# EasyEDA Pro project chunithm.epro, schematic Schematic1
Create Date: 2023-06-18; Page Name: P1; Project Name: chunithm_psoc; Schematic Name: Schematic1; Update Date: 2023-06-19; Company: 嘉立创EDA; Page Size: A3; Version: V1.0
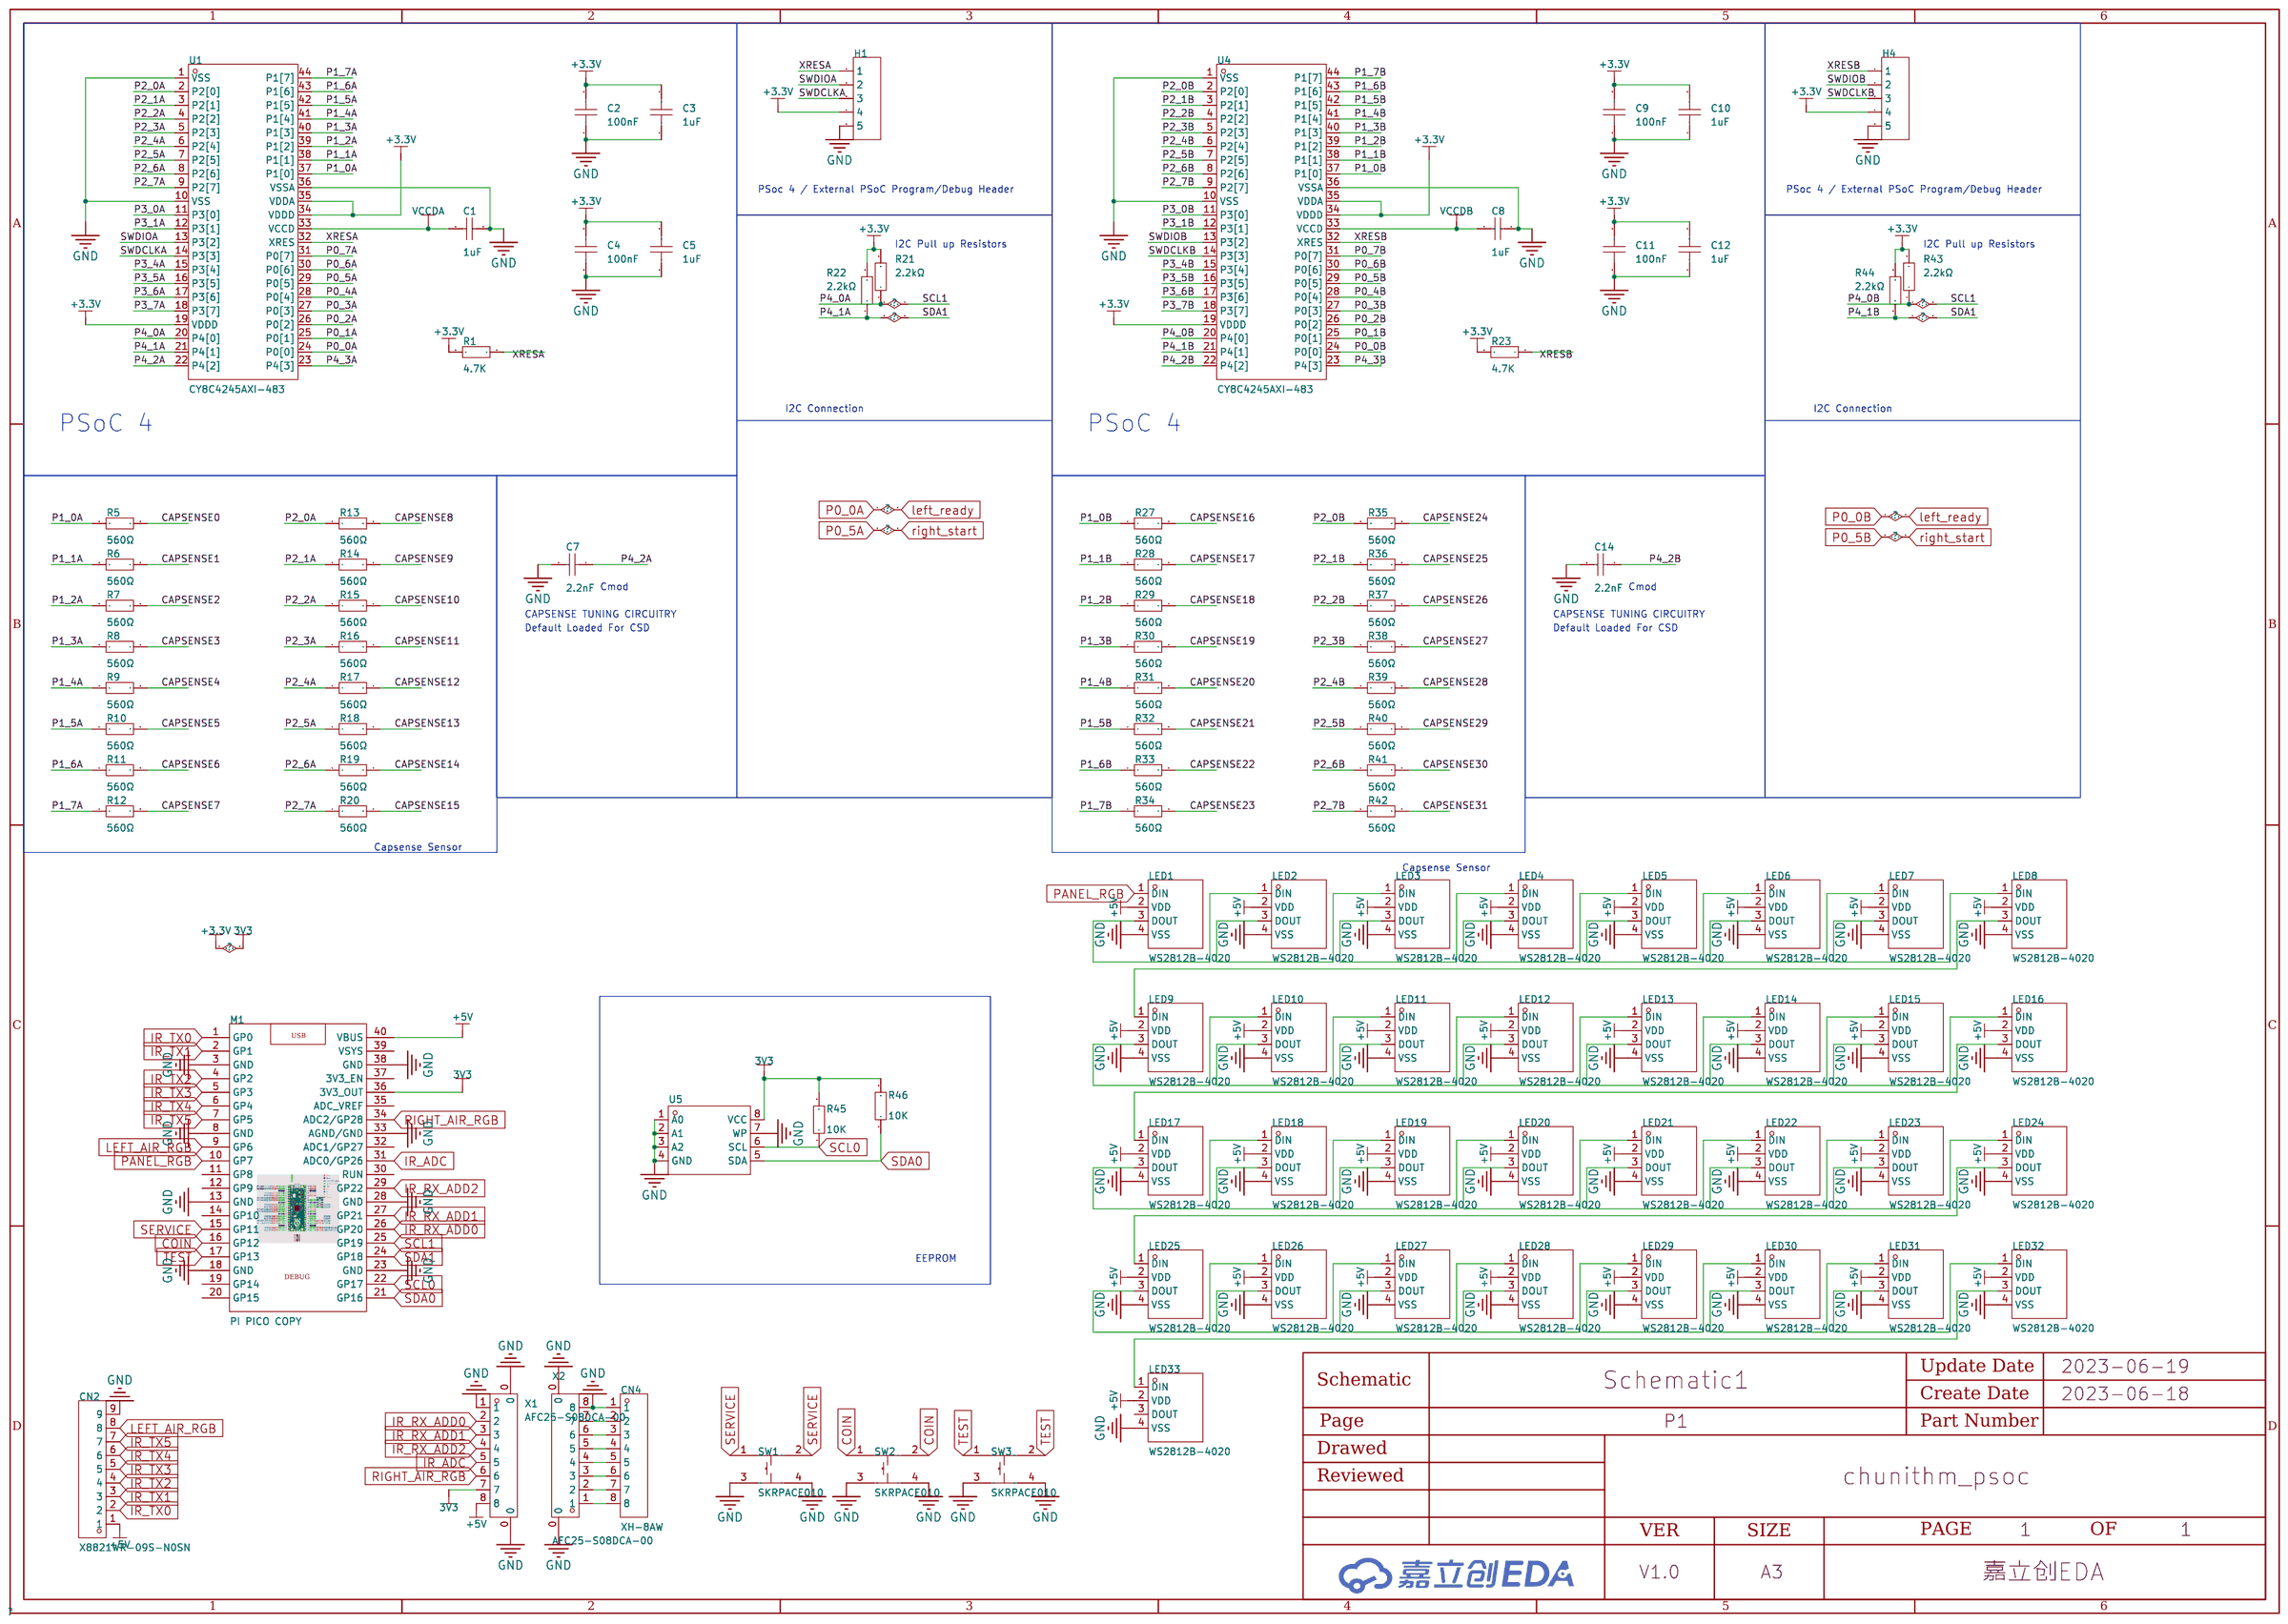
[diagram p0: schematic sheet]

## Parts
C1  1uF  [C0603]
C2  100nF  [C0603]
C3  1uF  [C0603]
C4  100nF  [C0603]
C5  1uF  [C0603]
C7  2.2nF  [C0603]
C8  1uF  [C0603]
C9  100nF  [C0603]
C10  1uF  [C0603]
C11  100nF  [C0603]
C12  1uF  [C0603]
C14  2.2nF  [C0603]
CN2  X8821WR-09S-N0SN  [CONN-TH_9P-P2.50_X8821WR-09S-N2SN]
CN4  XH-8AW  [CONN-TH_8P-P2.54_HCTL_XH-8AW_C2908617]
H1  -  [HDR-TH_5P-P2.54-V-F]
H4  -  [HDR-TH_5P-P2.54-V-F]
LED1  WS2812B-4020  [LED-SMD_WS2812B-4020]
LED2  WS2812B-4020  [LED-SMD_WS2812B-4020]
LED3  WS2812B-4020  [LED-SMD_WS2812B-4020]
LED4  WS2812B-4020  [LED-SMD_WS2812B-4020]
LED5  WS2812B-4020  [LED-SMD_WS2812B-4020]
LED6  WS2812B-4020  [LED-SMD_WS2812B-4020]
LED7  WS2812B-4020  [LED-SMD_WS2812B-4020]
LED8  WS2812B-4020  [LED-SMD_WS2812B-4020]
LED9  WS2812B-4020  [LED-SMD_WS2812B-4020]
LED10  WS2812B-4020  [LED-SMD_WS2812B-4020]
LED11  WS2812B-4020  [LED-SMD_WS2812B-4020]
LED12  WS2812B-4020  [LED-SMD_WS2812B-4020]
LED13  WS2812B-4020  [LED-SMD_WS2812B-4020]
LED14  WS2812B-4020  [LED-SMD_WS2812B-4020]
LED15  WS2812B-4020  [LED-SMD_WS2812B-4020]
LED16  WS2812B-4020  [LED-SMD_WS2812B-4020]
LED17  WS2812B-4020  [LED-SMD_WS2812B-4020]
LED18  WS2812B-4020  [LED-SMD_WS2812B-4020]
LED19  WS2812B-4020  [LED-SMD_WS2812B-4020]
LED20  WS2812B-4020  [LED-SMD_WS2812B-4020]
LED21  WS2812B-4020  [LED-SMD_WS2812B-4020]
LED22  WS2812B-4020  [LED-SMD_WS2812B-4020]
LED23  WS2812B-4020  [LED-SMD_WS2812B-4020]
LED24  WS2812B-4020  [LED-SMD_WS2812B-4020]
LED25  WS2812B-4020  [LED-SMD_WS2812B-4020]
LED26  WS2812B-4020  [LED-SMD_WS2812B-4020]
LED27  WS2812B-4020  [LED-SMD_WS2812B-4020]
LED28  WS2812B-4020  [LED-SMD_WS2812B-4020]
LED29  WS2812B-4020  [LED-SMD_WS2812B-4020]
LED30  WS2812B-4020  [LED-SMD_WS2812B-4020]
LED31  WS2812B-4020  [LED-SMD_WS2812B-4020]
LED32  WS2812B-4020  [LED-SMD_WS2812B-4020]
LED33  WS2812B-4020  [LED-SMD_WS2812B-4020]
M1  PI PICO COPY  [pipico]
R1  4.7K  [R0603]
R5  560Ω  [R0603]
R6  560Ω  [R0603]
R7  560Ω  [R0603]
R8  560Ω  [R0603]
R9  560Ω  [R0603]
R10  560Ω  [R0603]
R11  560Ω  [R0603]
R12  560Ω  [R0603]
R13  560Ω  [R0603]
R14  560Ω  [R0603]
R15  560Ω  [R0603]
R16  560Ω  [R0603]
R17  560Ω  [R0603]
R18  560Ω  [R0603]
R19  560Ω  [R0603]
R20  560Ω  [R0603]
R21  2.2kΩ  [R0603]
R22  2.2kΩ  [R0603]
R23  4.7K  [R0603]
R27  560Ω  [R0603]
R28  560Ω  [R0603]
R29  560Ω  [R0603]
R30  560Ω  [R0603]
R31  560Ω  [R0603]
R32  560Ω  [R0603]
R33  560Ω  [R0603]
R34  560Ω  [R0603]
R35  560Ω  [R0603]
R36  560Ω  [R0603]
R37  560Ω  [R0603]
R38  560Ω  [R0603]
R39  560Ω  [R0603]
R40  560Ω  [R0603]
R41  560Ω  [R0603]
R42  560Ω  [R0603]
R43  2.2kΩ  [R0603]
R44  2.2kΩ  [R0603]
R45  10K  [R0402]
R46  10K  [R0402]
SW1  SKRPACE010  [KEY-SMD_4P-L4.2-W3.2-P2.20-LS4.6]
SW2  SKRPACE010  [KEY-SMD_4P-L4.2-W3.2-P2.20-LS4.6]
SW3  SKRPACE010  [KEY-SMD_4P-L4.2-W3.2-P2.20-LS4.6]
U1  CY8C4245AXI-483  [TQFP-44_L10.0-W10.0-P0.80-BL]
U4  CY8C4245AXI-483  [TQFP-44_L10.0-W10.0-P0.80-BL]
U5  -  [TSSOP-8_L4.4-W3.0-P0.65-LS6.4-BL]
X1  AFC25-S08DCA-00  [CONN-SMD_8P-P2.50-L10.5-W25.0]
X2  AFC25-S08DCA-00  [CONN-SMD_8P-P2.50-L10.5-W25.0]

## Library data of the parts
C1 C8 = CL10A105KB8NNNC: 容值:1uF;精度:±10%;额定电压:50V;材质(温度系数):X5R;; LCSC Part Name: 1uF ±10% 50V; Supplier Part: C15849; Manufacturer: SAMSUNG(三星); Supplier Footprint: 0603; JLCPCB Part Class: Basic Part; Datasheet: https://atta.szlcsc.com/upload/public/pdf/source/20160103/1457707679084.pdf; Supplier: LCSC; Tolerance: ±10%; Voltage Rated: 50V; Temperature Coefficient: X5R
C2 C4 C9 C11 = CL10B104KB8NNNC: 容值:100nF;精度:±10%;额定电压:50V;材质(温度系数):X7R;; LCSC Part Name: 100nF ±10% 50V; Supplier Part: C1591; Manufacturer: SAMSUNG(三星); Supplier Footprint: 0603; JLCPCB Part Class: Extended Part; Datasheet: https://atta.szlcsc.com/upload/public/pdf/source/20160103/1457707680512.pdf; Supplier: LCSC; Tolerance: ±10%; Voltage Rated: 50V; Temperature Coefficient: X7R
C3 C5 C10 C12 = CC0603KRX7R9BB105: 容值:1uF;精度:±10%;额定电压:50V;材质(温度系数):X7R;; LCSC Part Name: 1uF ±10% 50V; Supplier Part: C559769; Manufacturer: YAGEO(国巨); Supplier Footprint: 0603; JLCPCB Part Class: Extended Part; Datasheet: https://atta.szlcsc.com/upload/public/pdf/source/20181031/C325451_C7CF01155AE3010E0D610C52F5FE7D31.pdf; Supplier: LCSC; Tolerance: ±10%; Voltage Rated: 50V; Temperature Coefficient: X7R
C7 C14 = CC0603KRX7R9BB222: 容值:2.2nF;精度:±10%;额定电压:50V;材质(温度系数):X7R;; LCSC Part Name: 2.2nF ±10% 50V; Supplier Part: C107082; Manufacturer: YAGEO(国巨); Supplier Footprint: 0603; JLCPCB Part Class: Extended Part; Datasheet: https://atta.szlcsc.com/upload/public/pdf/source/20170420/1492670716015.pdf; Supplier: LCSC; Tolerance: ±10%; Voltage Rated: 50V; Temperature Coefficient: X7R
CN2 = X8821WR-09S-N0SN: 参考系列:XH;间距:2.5mm;插针结构:1x9P;排数:1;每排PIN数:9;行距:-;公母:母型插口;安装方式:弯插;额定电流:3A;触头材质:黄铜;触头镀层:锡;工作温度范围:-25℃~+85℃;焊接温度(最大值):260℃;; LCSC Part Name: XH 2.5mm 1x9P 弯插 XH; Supplier Part: C388746; Manufacturer: XKB Connectivity(中国星坤); Supplier Footprint: 弯插,P=2.54mm; JLCPCB Part Class: Extended Part; Datasheet: https://atta.szlcsc.com/upload/public/pdf/source/20211009/984C14C41D2B1156BCF8EEF5D296E395.pdf; Supplier: LCSC; Reference Series: XH; Pitch: 2.5mm; Pins Structure: 1x9P; Number of Rows: 1; Number of PINs Per Row: 9; Gender: 母型插口; Mounting Style: 弯插; Current Rating (Max): 3A; Contact Material: 黄铜; Contact Plating: 锡; Operating Temperature Range: -25℃~+85℃; Welding Temperature (Max): 260℃
CN4 = XH-8AW: 参考系列:XH;间距:2.54mm;插针结构:1x8P;排数:1;每排PIN数:8;行距:-;公母:公型插针;安装方式:弯插;额定电流:3A;工作温度范围:-25℃~+85℃;; LCSC Part Name: XH 2.54mm 1x8P 弯插; Supplier Part: C2908617; Manufacturer: HCTL(华灿天禄); Supplier Footprint: 弯插,P=2.54mm; JLCPCB Part Class: Extended Part; Datasheet: https://atta.szlcsc.com/upload/public/pdf/source/20211021/ACA2D54D99493880102FCACAC8DAABA8.pdf; Supplier: LCSC; Reference Series: XH; Pitch: 2.54mm; Pins Structure: 1x8P; Number of Rows: 1; Number of PINs Per Row: 8; Gender: 公型插针; Mounting Style: 弯插; Current Rating (Max): 3A; Operating Temperature Range: -25℃~+85℃
H1 H4 = HDR-F_2.54_1x5P: Supplier Part: C50950; Supplier Footprint: 插件; Check: false
LED1-LED33 = WS2812B-4020: 发光颜色:RGB三色;二极管配置:-;主波长:465nm~475nm；620nm~625nm；515nm~525nm;色温:-;功率:-;安装方式:-;; LCSC Part Name: RGB三色 （注意防潮，请查阅规格书中对应具体内容）; Supplier Part: C965557; Manufacturer: worldsemi; Supplier Footprint: SMD,2x4mm; JLCPCB Part Class: Extended Part; Datasheet: https://atta.szlcsc.com/upload/public/pdf/source/20201203/C965557_D4D919E14814D6BA44043987D39B5520.pdf; Supplier: LCSC; Emitted Color: RGB三色; Dominant Wavelength: 465nm~475nm；620nm~625nm；515nm~525nm; Forward Current: 12mA
M1 = PI PICO COPY: link: https://datasheets.raspberrypi.org/pico/pico-product-brief.pdf
R1 R23 = Res_0603: Supplier Footprint: 0603
R5-R20 R27-R42 = 0603WAF5600T5E: 电阻类型:厚膜电阻;阻值:560Ω;精度:±1%;功率:100mW;; LCSC Part Name: 560Ω ±1% 100mW; Supplier Part: C23204; Manufacturer: UNI-ROYAL(厚声); Supplier Footprint: 0603; JLCPCB Part Class: Basic Part; Datasheet: https://atta.szlcsc.com/upload/public/pdf/source/20200306/C422600_1E6D84923E4A46A82E41ADD87F860B5C.pdf; Supplier: LCSC; Type: 厚膜电阻; Tolerance: ±1%; Power(Watts): 100mW; Temperature Coefficient: ±100ppm/℃; Overload Voltage (Max): 75V; Operating Temperature Range: -55℃~+155℃
R21 R22 R43 R44 = 0603WAF2201T5E: 电阻类型:厚膜电阻;阻值:2.2kΩ;精度:±1%;功率:100mW;; LCSC Part Name: 2.2kΩ ±1% 100mW; Supplier Part: C4190; Manufacturer: UNI-ROYAL(厚声); Supplier Footprint: 0603; JLCPCB Part Class: Basic Part; Datasheet: https://atta.szlcsc.com/upload/public/pdf/source/20200306/C422600_1E6D84923E4A46A82E41ADD87F860B5C.pdf; Supplier: LCSC; Type: 厚膜电阻; Tolerance: ±1%; Power(Watts): 100mW; Temperature Coefficient: ±100ppm/℃; Overload Voltage (Max): 75V; Operating Temperature Range: -55℃~+155℃
R45 R46 = Res_0402: Supplier Footprint: 0402
SW1-SW3 = SKRPACE010: 触点电流:50mA;额定电压(DC):16V;电路结构:单刀单掷;安装方式:立贴;带灯:-;机械寿命:-;; LCSC Part Name: 4.2*3.2*2.5mm 立贴 轻触开关; Supplier Part: C139797; Manufacturer: ALPSALPINE(阿尔卑斯阿尔派); Supplier Footprint: SMD; JLCPCB Part Class: Extended Part; Datasheet: https://atta.szlcsc.com/upload/public/pdf/source/20171113/C139797_15105612676371115729.pdf; Supplier: LCSC; Contact Current: 50mA; Voltage Rating (DC): 16V; Circuit: 单刀单掷; Mounting Style: 立贴; Actuator Style: 椭圆形按钮; Switch Length: 4.2mm; Switch Width: 3.2mm; Switch Height: 2.5mm
U1 U4 = CY8C4245AXI-483: CPU最大主频:48MHz;程序存储容量:32KB;GPIO端口数量:36;; LCSC Part Name: 48MHz; Supplier Part: C462527; Manufacturer: CYPRESS(赛普拉斯); Supplier Footprint: TQFP-44(10x10); JLCPCB Part Class: Extended Part; Datasheet: https://atta.szlcsc.com/upload/public/pdf/source/20200102/C475891_D692656D7ACA53C6511AD0E00550D7D7.pdf; Supplier: LCSC; CPU Maximum Speed: 48MHz; Operating Voltage Range: 1.71V~5.5V; Program Storage Size: 32KB; GPIO Ports Number: 36; ADC (Bit): 12bit; Watchdog: 有; Infrared Data Association: 有; Low-Voltage Detect: 有; LCD Module: 有; Internal Oscillator: 有; Operating Temperature Range: 40℃~+85℃
U5 = BL24C512A-SFRC: 存储器容量:512Kb (64K x 8);存储器接口类型:I2C;工作电压:1.7V ~ 5.5V;; Supplier Part: C169114; Manufacturer: BL(上海贝岭); Supplier Footprint: TSSOP-8_3x4.4x065P; JLCPCB Part Class: Extended Part; Datasheet: https://atta.szlcsc.com/upload/public/pdf/source/20180126/C169114_15169517524601308555.pdf; Supplier: LCSC; Memory Format: EEPROM; Memory Size: 512Kb (64K x 8); Memory Interface: I2C; Voltage - Supply: 1.7V ~ 5.5V
X1 X2 = AFC25-S08DCA-00: 参考系列:XH;间距:2.5mm;插针结构:1x8P;排数:1;每排PIN数:8;行距:-;公母:公型插针;安装方式:卧贴;额定电流:3A;工作温度范围:-20℃~+85℃;; LCSC Part Name: XH 2.5mm 卧式贴片 8P; Supplier Part: C2764247; Manufacturer: JS(钜硕电子); Supplier Footprint: SMD,P=2.5mm; JLCPCB Part Class: Extended Part; Datasheet: https://atta.szlcsc.com/upload/public/pdf/source/20210330/C2764241_412E231661FA78F85357ABAC285E64EE.pdf; Supplier: LCSC; Reference Series: XH; Pitch: 2.5mm; Pins Structure: 1x8P; Number of Rows: 1; Number of PINs Per Row: 8; Gender: 公型插针; Mounting Style: 卧贴; Current Rating (Max): 3A; Operating Temperature Range: -20℃~+85℃

## Nets
+3.3V: C2.2 C3.2 C4.2 C5.2 C9.2 C10.2 C11.2 C12.2 H1.4 H4.4 M1.36(3V3_OUT) R1.2 R21.2 R22.2 R23.2 R43.2 R44.2 R45.2 R46.2 U1.19(VDDD) U1.34(VDDD) U1.35(VDDA) U4.19(VDDD) U4.34(VDDD) U4.35(VDDA) U5.8(VCC) X1.7
+5V: CN2.1 LED1.2(VDD) LED2.2(VDD) LED3.2(VDD) LED4.2(VDD) LED5.2(VDD) LED6.2(VDD) LED7.2(VDD) LED8.2(VDD) LED9.2(VDD) LED10.2(VDD) LED11.2(VDD) LED12.2(VDD) LED13.2(VDD) LED14.2(VDD) LED15.2(VDD) LED16.2(VDD) LED17.2(VDD) LED18.2(VDD) LED19.2(VDD) LED20.2(VDD) LED21.2(VDD) LED22.2(VDD) LED23.2(VDD) LED24.2(VDD) LED25.2(VDD) LED26.2(VDD) LED27.2(VDD) LED28.2(VDD) LED29.2(VDD) LED30.2(VDD) LED31.2(VDD) LED32.2(VDD) LED33.2(VDD) M1.40(VBUS) X1.8
GND: C1.2 C2.1 C3.1 C4.1 C5.1 C7.2 C8.2 C9.1 C10.1 C11.1 C12.1 C14.2 CN2.9 CN4.1 H1.5 H4.5 LED1.4(VSS) LED2.4(VSS) LED3.4(VSS) LED4.4(VSS) LED5.4(VSS) LED6.4(VSS) LED7.4(VSS) LED8.4(VSS) LED9.4(VSS) LED10.4(VSS) LED11.4(VSS) LED12.4(VSS) LED13.4(VSS) LED14.4(VSS) LED15.4(VSS) LED16.4(VSS) LED17.4(VSS) LED18.4(VSS) LED19.4(VSS) LED20.4(VSS) LED21.4(VSS) LED22.4(VSS) LED23.4(VSS) LED24.4(VSS) LED25.4(VSS) LED26.4(VSS) LED27.4(VSS) LED28.4(VSS) LED29.4(VSS) LED30.4(VSS) LED31.4(VSS) LED32.4(VSS) LED33.4(VSS) M1.3(GND) M1.8(GND) M1.13(GND) M1.18(GND) M1.23(GND) M1.28(GND) M1.33(AGND/GND) M1.38(GND) SW1.3 SW1.4 SW2.3 SW2.4 SW3.3 SW3.4 U1.1(VSS) U1.10(VSS) U1.36(VSSA) U4.1(VSS) U4.10(VSS) U4.36(VSSA) U5.1(A0) U5.2(A1) U5.3(A2) U5.4(GND) U5.7(WP) X1.0 X1.1 X2.0 X2.8
VCCDA: C1.1 U1.33(VCCD)
VCCDB: C8.1 U4.33(VCCD)
CAPSENSE0: R5.2
CAPSENSE1: R6.2
CAPSENSE2: R7.2
CAPSENSE3: R8.2
CAPSENSE4: R9.2
CAPSENSE5: R10.2
CAPSENSE6: R11.2
CAPSENSE7: R12.2
CAPSENSE8: R13.2
CAPSENSE9: R14.2
CAPSENSE10: R15.2
CAPSENSE11: R16.2
CAPSENSE12: R17.2
CAPSENSE13: R18.2
CAPSENSE14: R19.2
CAPSENSE15: R20.2
CAPSENSE16: R27.2
CAPSENSE17: R28.2
CAPSENSE18: R29.2
CAPSENSE19: R30.2
CAPSENSE20: R31.2
CAPSENSE21: R32.2
CAPSENSE22: R33.2
CAPSENSE23: R34.2
CAPSENSE24: R35.2
CAPSENSE25: R36.2
CAPSENSE26: R37.2
CAPSENSE27: R38.2
CAPSENSE28: R39.2
CAPSENSE29: R40.2
CAPSENSE30: R41.2
CAPSENSE31: R42.2
COIN: M1.16(GP12) SW2.1 SW2.2
IR_ADC: M1.31(ADC0/GP26) X1.5
IR_RX_ADD0: M1.26(GP20) X1.2
IR_RX_ADD1: M1.27(GP21) X1.3
IR_RX_ADD2: M1.29(GP22) X1.4
IR_TX0: CN2.2 M1.1(GP0)
IR_TX1: CN2.3 M1.2(GP1)
IR_TX2: CN2.4 M1.4(GP2)
IR_TX3: CN2.5 M1.5(GP3)
IR_TX4: CN2.6 M1.6(GP4)
IR_TX5: CN2.7 M1.7(GP5)
LEFT_AIR_RGB: CN2.8 M1.9(GP6)
P0_0A: U1.24(P0[0]) U4.24(P0[0])
P0_1A: U1.25(P0[1])
P0_1B: U4.25(P0[1])
P0_2A: U1.26(P0[2])
P0_2B: U4.26(P0[2])
P0_3A: U1.27(P0[3])
P0_3B: U4.27(P0[3])
P0_4A: U1.28(P0[4])
P0_4B: U4.28(P0[4])
P0_5A: U1.29(P0[5]) U4.29(P0[5])
P0_6A: U1.30(P0[6])
P0_6B: U4.30(P0[6])
P0_7A: U1.31(P0[7])
P0_7B: U4.31(P0[7])
P1_0A: R5.1 U1.37(P1[0])
P1_0B: R27.1 U4.37(P1[0])
P1_1A: R6.1 U1.38(P1[1])
P1_1B: R28.1 U4.38(P1[1])
P1_2A: R7.1 U1.39(P1[2])
P1_2B: R29.1 U4.39(P1[2])
P1_3A: R8.1 U1.40(P1[3])
P1_3B: R30.1 U4.40(P1[3])
P1_4A: R9.1 U1.41(P1[4])
P1_4B: R31.1 U4.41(P1[4])
P1_5A: R10.1 U1.42(P1[5])
P1_5B: R32.1 U4.42(P1[5])
P1_6A: R11.1 U1.43(P1[6])
P1_6B: R33.1 U4.43(P1[6])
P1_7A: R12.1 U1.44(P1[7])
P1_7B: R34.1 U4.44(P1[7])
P2_0A: R13.1 U1.2(P2[0])
P2_0B: R35.1 U4.2(P2[0])
P2_1A: R14.1 U1.3(P2[1])
P2_1B: R36.1 U4.3(P2[1])
P2_2A: R15.1 U1.4(P2[2])
P2_2B: R37.1 U4.4(P2[2])
P2_3A: R16.1 U1.5(P2[3])
P2_3B: R38.1 U4.5(P2[3])
P2_4A: R17.1 U1.6(P2[4])
P2_4B: R39.1 U4.6(P2[4])
P2_5A: R18.1 U1.7(P2[5])
P2_5B: R40.1 U4.7(P2[5])
P2_6A: R19.1 U1.8(P2[6])
P2_6B: R41.1 U4.8(P2[6])
P2_7A: R20.1 U1.9(P2[7])
P2_7B: R42.1 U4.9(P2[7])
P3_0A: U1.11(P3[0])
P3_0B: U4.11(P3[0])
P3_1A: U1.12(P3[1])
P3_1B: U4.12(P3[1])
P3_4A: U1.15(P3[4])
P3_4B: U4.15(P3[4])
P3_5A: U1.16(P3[5])
P3_5B: U4.16(P3[5])
P3_6A: U1.17(P3[6])
P3_6B: U4.17(P3[6])
P3_7A: U1.18(P3[7])
P3_7B: U4.18(P3[7])
P4_0A: M1.25(GP19) R21.1 R43.1 U1.20(P4[0]) U4.20(P4[0])
P4_1A: M1.24(GP18) R22.1 R44.1 U1.21(P4[1]) U4.21(P4[1])
P4_2A: C7.1 U1.22(P4[2])
P4_2B: C14.1 U4.22(P4[2])
P4_3A: U1.23(P4[3])
P4_3B: U4.23(P4[3])
PANEL_RGB: LED1.1(DIN) M1.10(GP7)
RIGHT_AIR_RGB: M1.34(ADC2/GP28) X1.6
SCL0: M1.22(GP17) R45.1 U5.6(SCL)
SDA0: M1.21(GP16) R46.1 U5.5(SDA)
SERVICE: M1.15(GP11) SW1.1 SW1.2
SWDCLKA: H1.3 U1.14(P3[3])
SWDCLKB: H4.3 U4.14(P3[3])
SWDIOA: H1.2 U1.13(P3[2])
SWDIOB: H4.2 U4.13(P3[2])
TEST: M1.17(GP13) SW3.1 SW3.2
XRESA: H1.1 R1.1 U1.32(XRES)
XRESB: H4.1 R23.1 U4.32(XRES)
$1N13625: LED1.3(DOUT) LED2.1(DIN)
$1N13632: LED2.3(DOUT) LED3.1(DIN)
$1N13639: LED3.3(DOUT) LED4.1(DIN)
$1N13646: LED4.3(DOUT) LED5.1(DIN)
$1N13653: LED5.3(DOUT) LED6.1(DIN)
$1N13660: LED6.3(DOUT) LED7.1(DIN)
$1N13667: LED7.3(DOUT) LED8.1(DIN)
$1N13674: LED8.3(DOUT) LED9.1(DIN)
$1N13680: LED9.3(DOUT) LED10.1(DIN)
$1N13687: LED10.3(DOUT) LED11.1(DIN)
$1N13694: LED11.3(DOUT) LED12.1(DIN)
$1N13701: LED12.3(DOUT) LED13.1(DIN)
$1N13708: LED13.3(DOUT) LED14.1(DIN)
$1N13715: LED14.3(DOUT) LED15.1(DIN)
$1N13722: LED15.3(DOUT) LED16.1(DIN)
$1N13729: LED16.3(DOUT) LED17.1(DIN)
$1N13735: LED17.3(DOUT) LED18.1(DIN)
$1N13742: LED18.3(DOUT) LED19.1(DIN)
$1N13749: LED19.3(DOUT) LED20.1(DIN)
$1N13756: LED20.3(DOUT) LED21.1(DIN)
$1N13763: LED21.3(DOUT) LED22.1(DIN)
$1N13770: LED22.3(DOUT) LED23.1(DIN)
$1N13777: LED23.3(DOUT) LED24.1(DIN)
$1N13784: LED24.3(DOUT) LED25.1(DIN)
$1N13790: LED25.3(DOUT) LED26.1(DIN)
$1N13797: LED26.3(DOUT) LED27.1(DIN)
$1N13804: LED27.3(DOUT) LED28.1(DIN)
$1N13811: LED28.3(DOUT) LED29.1(DIN)
$1N13818: LED29.3(DOUT) LED30.1(DIN)
$1N13825: LED30.3(DOUT) LED31.1(DIN)
$1N13832: LED31.3(DOUT) LED32.1(DIN)
$1N13839: LED32.3(DOUT) LED33.1(DIN)
$1N18505: CN4.2 X2.7
$1N18507: CN4.3 X2.6
$1N18509: CN4.4 X2.5
$1N18511: CN4.5 X2.4
$1N18513: CN4.6 X2.3
$1N18515: CN4.7 X2.2
$1N18517: CN4.8 X2.1

Not connected (* = marked no-connect by the designer): LED33 3(DOUT); M1 11(GP8) 12(GP9) 14(GP10) 19(GP14) 20(GP15) 30(RUN) 32(ADC1/GP27) 35(ADC_VREF) 37(3V3_EN) 39(VSYS)

## Notes on the sheet
- PSoc 4 / External PSoC Program/Debug Header
- PSoc 4 / External PSoC Program/Debug Header
- I2C Pull up Resistors
- I2C Pull up Resistors
- I2C Connection
- I2C Connection
- PSoC 4
- PSoC 4
- Cmod
- Cmod
- CAPSENSE TUNING CIRCUITRY
- CAPSENSE TUNING CIRCUITRY
- Default Loaded For CSD
- Default Loaded For CSD
- Capsense Sensor
- Capsense Sensor
- EEPROM
